# Altium schematic sheet SCH_LED_7_SEG.SchDoc
size A3; SheetNumber: 2; SheetTotal: 10
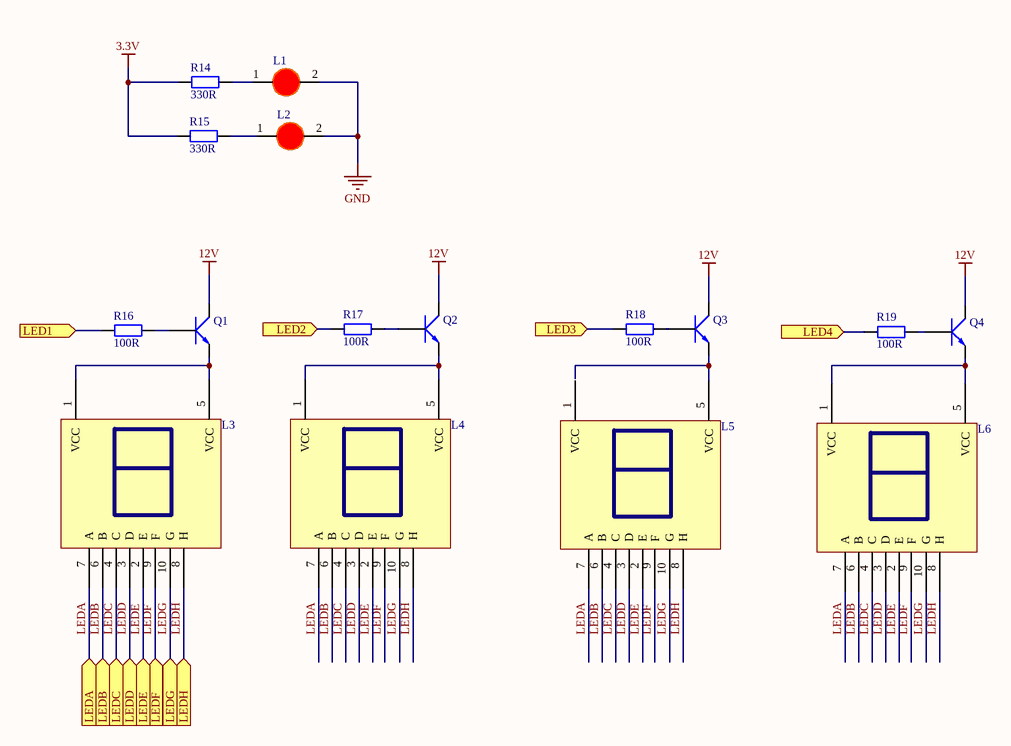
[diagram p0: SCH_LED_7_SEG.SchDoc]

## Parts
L1  (no value)  [LED-3MM-RED]
L2  (no value)  [LED-3MM-RED]
L3  (no value)  [LED7SEG_2.3inch]
L4  (no value)  [LED7SEG_2.3inch]
L5  (no value)  [LED7SEG_2.3inch]
L6  (no value)  [LED7SEG_2.3inch]
Q1  (no value)  [SOT23]
Q2  (no value)  [SOT23]
Q3  (no value)  [SOT23]
Q4  (no value)  [SOT23]
R14  330R  [tro smd 0603]
R15  330R  [tro smd 0603]
R16  100R  [tro smd 0805]
R17  100R  [tro smd 0805]
R18  100R  [tro smd 0805]
R19  100R  [tro smd 0805]

## Ports
LED1 (in), LED2 (in), LED3 (in), LED4 (in), LEDA (in), LEDB (in), LEDC (in), LEDD (in), LEDE (in), LEDF (in), LEDG (in), LEDH (in)

## Nets
3.3V: R14.1 R15.1
12V: Q1.3(C) Q2.3(C) Q3.3(C) Q4.3(C)
GND: L1.2(K) L2.2(K)
LED1: R16.1 ; port LED1
LED2: R17.1 ; port LED2
LED3: R18.1 ; port LED3
LED4: R19.1 ; port LED4
LEDA: L3.7(A) L4.7(A) L5.7(A) L6.7(A) ; port LEDA
LEDB: L3.6(B) L4.6(B) L5.6(B) L6.6(B) ; port LEDB
LEDC: L3.4(C) L4.4(C) L5.4(C) L6.4(C) ; port LEDC
LEDD: L3.3(D) L4.3(D) L5.3(D) L6.3(D) ; port LEDD
LEDE: L3.2(E) L4.2(E) L5.2(E) L6.2(E) ; port LEDE
LEDF: L3.9(F) L4.9(F) L5.9(F) L6.9(F) ; port LEDF
LEDG: L3.10(G) L4.10(G) L5.10(G) L6.10(G) ; port LEDG
LEDH: L3.8(H) L4.8(H) L5.8(H) L6.8(H) ; port LEDH
NetL1_1: L1.1(A) R14.2
NetL2_1: L2.1(A) R15.2
NetL3_1: L3.1(VCC) L3.5(VCC) Q1.2(E)
NetL4_1: L4.1(VCC) L4.5(VCC) Q2.2(E)
NetL5_5: L5.5(VCC) Q3.2(E)
NetL6_1: L6.1(VCC) L6.5(VCC) Q4.2(E)
NetQ1_1: Q1.1(B) R16.2
NetQ2_1: Q2.1(B) R17.2
NetQ3_1: Q3.1(B) R18.2
NetQ4_1: Q4.1(B) R19.2

Not connected (* = marked no-connect by the designer): L5 1(VCC)

## Library data of the parts
L1 L2 = LED 3mm Do: Cắm; Don_Vi: Con; Ma_Hang: MH003892; Ten_Linh_Kien: Led 3MM Phủ Đỏ (10c); Ghi_Chu: *; Kieu_Chan: *; Chung_Loai: Cắm
L3-L6 = LED 7x1 2.3inch Anot: Dán; Don_Vi: Con; Ma_Hang: MH000901; Ten_Linh_Kien: Led 7 2.3 1 Số Anot (Sáng Đỏ); Ghi_Chu: *; Kieu_Chan: *; Chung_Loai: Dán
Q1-Q4 = C1815 HF SMD: NPN transistor; Value: C9014
R14 R15 = Tro 0603 5% 330R: Dán; Don_Vi: Con; Ma_Hang: MH006910; So_Chan: 2; Ten_Linh_Kien: Trở 0603 5% 330R; Chung_Loai: Dán; Kieu_Chan: *
R16-R19 = Tro 0805 5% 100R: Dán; Don_Vi: Con; So_Chan: 2; Ten_Linh_Kien: Trở 0805 5% 100R; Ma_Hang: MH005251; Chung_Loai: Dán; Kieu_Chan: *